# Altium project 4-Bit-BCD-Adder-Subtractor.PrjPcb
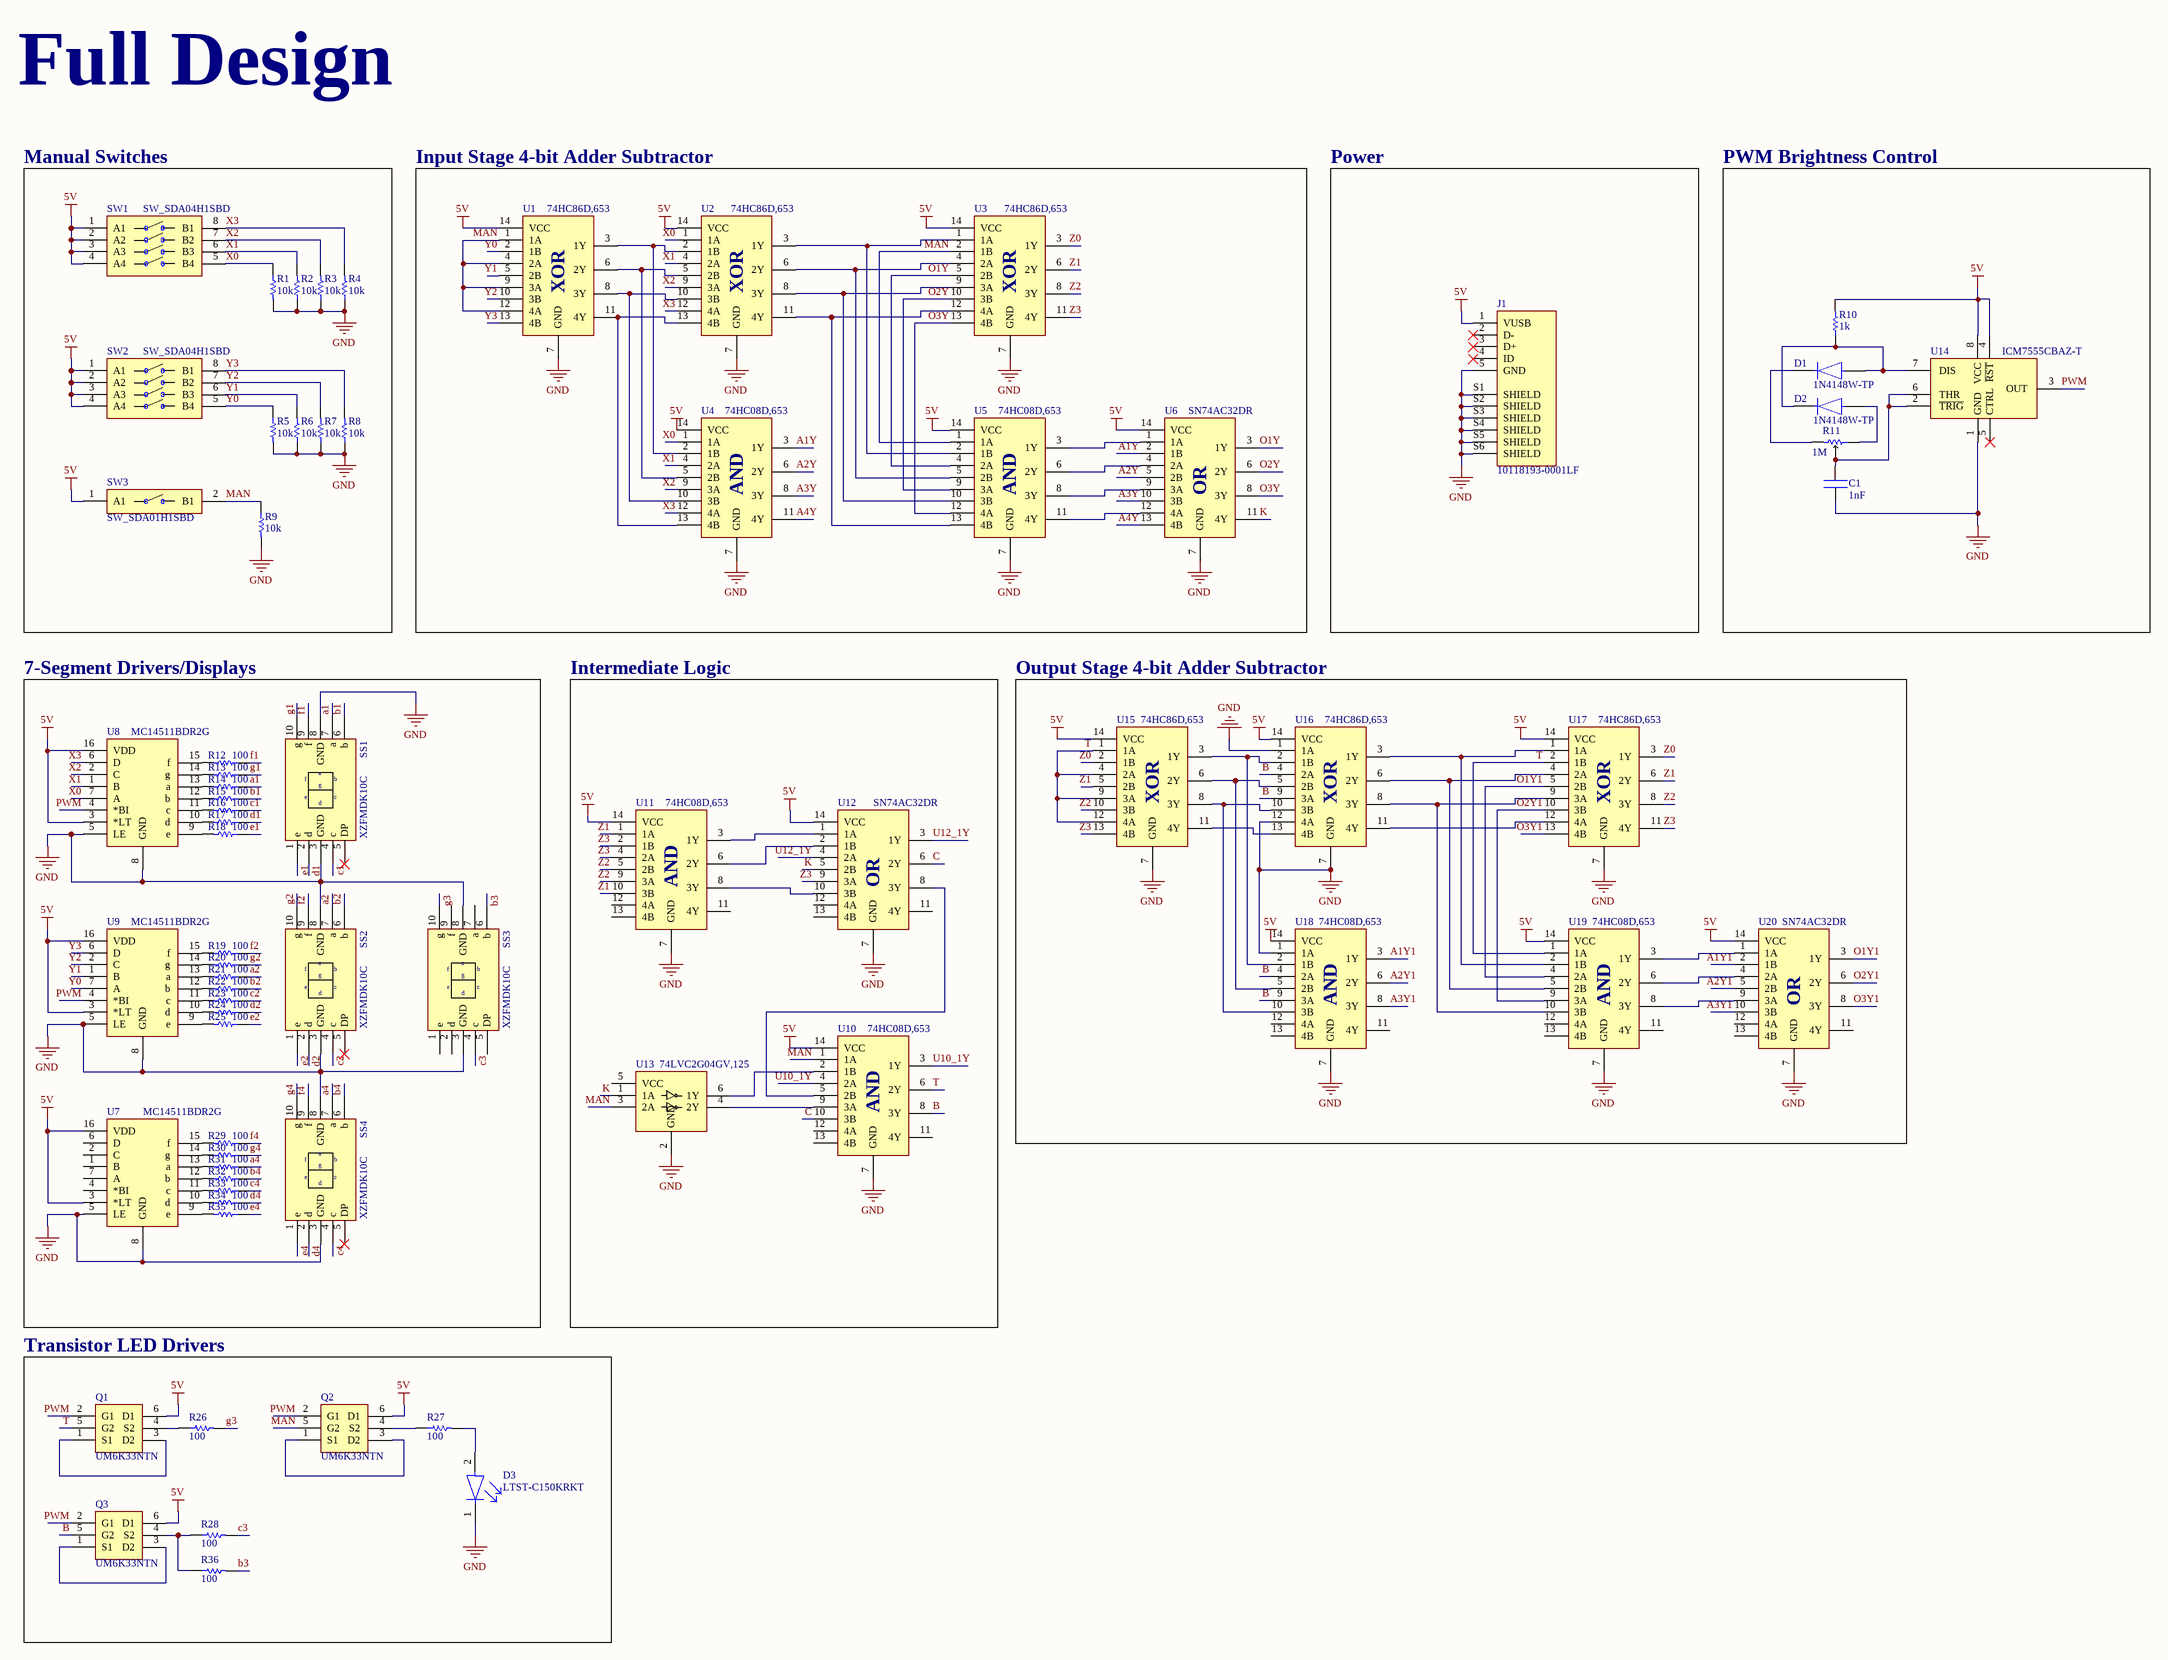
[diagram p0: 4B-BCD-AS.SchDoc]
1 sheet, 71 parts. Net scope: global (net labels, ports and power ports of the same name join across sheets).
Board file: PCB1.PcbDoc

## Sheet 4B-BCD-AS.SchDoc
size C; SheetNumber: 1; SheetTotal: 1

### Parts
C1  1nF  [FP-CL31-IPC_A]
D1  1N4148W-TP  [FP-SOD-123-MFG]
D2  1N4148W-TP  [FP-SOD-123-MFG]
D3  LTST-C150KRKT  [FP-LTST-C150KRKT-MFG]
J1  10118193-0001LF  [FCI_10118193-0001LF]
Q1  UM6K33NTN  [FP-SOT363-IPC_A]
Q2  UM6K33NTN  [FP-SOT363-IPC_A]
Q3  UM6K33NTN  [FP-SOT363-IPC_A]
R1  10k  [RESC3116X65X40ML10T20]
R2  10k  [RESC3116X65X40ML10T20]
R3  10k  [RESC3116X65X40ML10T20]
R4  10k  [RESC3116X65X40ML10T20]
R5  10k  [RESC3116X65X40ML10T20]
R6  10k  [RESC3116X65X40ML10T20]
R7  10k  [RESC3116X65X40ML10T20]
R8  10k  [RESC3116X65X40ML10T20]
R9  10k  [RESC3116X65X40ML10T20]
R10  1k  [RESC3116X65X40ML10T20]
R11  1M  [ST4ETA105]
R12  100  [RESC3116X65X40ML10T20]
R13  100  [RESC3116X65X40ML10T20]
R14  100  [RESC3116X65X40ML10T20]
R15  100  [RESC3116X65X40ML10T20]
R16  100  [RESC3116X65X40ML10T20]
R17  100  [RESC3116X65X40ML10T20]
R18  100  [RESC3116X65X40ML10T20]
R19  100  [RESC3116X65X40ML10T20]
R20  100  [RESC3116X65X40ML10T20]
R21  100  [RESC3116X65X40ML10T20]
R22  100  [RESC3116X65X40ML10T20]
R23  100  [RESC3116X65X40ML10T20]
R24  100  [RESC3116X65X40ML10T20]
R25  100  [RESC3116X65X40ML10T20]
R26  100  [RESC3116X65X40ML10T20]
R27  100  [RESC3116X65X40ML10T20]
R28  100  [RESC3116X65X40ML10T20]
R29  100  [RESC3116X65X40ML10T20]
R30  100  [RESC3116X65X40ML10T20]
R31  100  [RESC3116X65X40ML10T20]
R32  100  [RESC3116X65X40ML10T20]
R33  100  [RESC3116X65X40ML10T20]
R34  100  [RESC3116X65X40ML10T20]
R35  100  [RESC3116X65X40ML10T20]
R36  100  [RESC3116X65X40ML10T20]
SS1  XZFMDK10C  [XZFMDK10C]
SS2  XZFMDK10C  [XZFMDK10C]
SS3  XZFMDK10C  [XZFMDK10C]
SS4  XZFMDK10C  [XZFMDK10C]
SW1  SW_SDA04H1SBD  [SW_SDA04H1SBD]
SW2  SW_SDA04H1SBD  [SW_SDA04H1SBD]
SW3  SW_SDA01H1SBD  [SW_SDA01H1SBD]
U1  74HC86D,653  [SOIC127P600X175-14N]
U2  74HC86D,653  [SOIC127P600X175-14N]
U3  74HC86D,653  [SOIC127P600X175-14N]
U4  74HC08D,653  [SOIC127P600X175-14N]
U5  74HC08D,653  [SOIC127P600X175-14N]
U6  SN74AC32DR  [SOIC127P600X175-14N]
U7  MC14511BDR2G  [SOIC-16_ONS-M]
U8  MC14511BDR2G  [SOIC-16_ONS-M]
U9  MC14511BDR2G  [SOIC-16_ONS-M]
U10  74HC08D,653  [SOIC127P600X175-14N]
U11  74HC08D,653  [SOIC127P600X175-14N]
U12  SN74AC32DR  [SOIC127P600X175-14N]
U13  74LVC2G04GV,125  [SOT95P275X110-6N]
U14  ICM7555CBAZ-T  [FP-M8_15-MFG]
U15  74HC86D,653  [SOIC127P600X175-14N]
U16  74HC86D,653  [SOIC127P600X175-14N]
U17  74HC86D,653  [SOIC127P600X175-14N]
U18  74HC08D,653  [SOIC127P600X175-14N]
U19  74HC08D,653  [SOIC127P600X175-14N]
U20  SN74AC32DR  [SOIC127P600X175-14N]

### Blocks framed on the sheet
Manual Switches: R1-R9 SW1-SW3
Input Stage 4-bit Adder Subtractor: U1-U6
Power: J1
PWM Brightness Control: C1 D1 D2 R10 R11 U14
7-Segment Drivers/Displays: R12-R25 R29-R35 SS1-SS4 U7-U9
Intermediate Logic: U10-U13
Output Stage 4-bit Adder Subtractor: U15-U20
Transistor LED Drivers: D3 Q1-Q3 R26-R28 R36

### Nets
5V: J1.1(VUSB) Q1.6(D1) Q2.6(D1) Q3.6(D1) R10.2 SW1.1(A1) SW1.2(A2) SW1.3(A3) SW1.4(A4) SW2.1(A1) SW2.2(A2) SW2.3(A3) SW2.4(A4) SW3.1(A1) U1.14(VCC) U2.14(VCC) U3.14(VCC) U4.14(VCC) U5.14(VCC) U6.14(VCC) U7.3(*LT) U7.16(VDD) U8.3(*LT) U8.16(VDD) U9.3(*LT) U9.16(VDD) U10.14(VCC) U11.14(VCC) U12.14(VCC) U14.4(~{RST}) U14.8(VCC) U15.14(VCC) U16.14(VCC) U17.14(VCC) U18.14(VCC) U19.14(VCC) U20.14(VCC)
GND: C1.1 D3.1(C) J1.5(GND) J1.S1(SHIELD) J1.S2(SHIELD) J1.S3(SHIELD) J1.S4(SHIELD) J1.S5(SHIELD) J1.S6(SHIELD) R1.2 R2.1 R3.1 R4.1 R5.2 R6.1 R7.1 R8.1 R9.2 SS1.3(GND) SS1.8(GND) SS2.3(GND) SS2.8(GND) SS3.3(GND) SS3.8(GND) SS4.3(GND) SS4.8(GND) U1.7(GND) U2.7(GND) U3.7(GND) U4.7(GND) U5.7(GND) U6.7(GND) U7.5(LE) U7.8(GND) U8.5(LE) U8.8(GND) U9.5(LE) U9.8(GND) U10.7(GND) U11.7(GND) U12.7(GND) U13.2(GND) U14.1(GND) U15.7(GND) U16.1(1A) U16.7(GND) U16.12(4A) U17.7(GND) U18.1(1A) U18.7(GND) U19.7(GND) U20.7(GND)
a1: R14.1 SS1.7(a)
A1Y: U4.3(1Y) U6.2(1B)
A1Y1: U18.3(1Y) U20.2(1B)
a2: R21.1 SS2.7(a)
A2Y: U4.6(2Y) U6.5(2B)
A2Y1: U18.6(2Y) U20.5(2B)
A3Y: U4.8(3Y) U6.10(3B)
A3Y1: U18.8(3Y) U20.10(3B)
a4: R31.1 SS4.7(a)
A4Y: U4.11(4Y) U6.13(4B)
B: Q3.5(G2) U10.8(3Y) U16.4(2A) U16.9(3A) U18.4(2A) U18.9(3A)
b1: R15.1 SS1.6(b)
b2: R22.1 SS2.6(b)
b3: R36.2 SS3.6(b)
b4: R32.1 SS4.6(b)
C: U10.10(3B) U12.6(2Y)
c1: R16.1 SS1.4(c)
c2: R23.1 SS2.4(c)
c3: R28.2 SS3.4(c)
c4: R33.1 SS4.4(c)
d1: R17.1 SS1.2(d)
d2: R24.1 SS2.2(d)
d4: R34.1 SS4.2(d)
e1: R18.1 SS1.1(e)
e2: R25.1 SS2.1(e)
e4: R35.1 SS4.1(e)
f1: R12.1 SS1.9(f)
f2: R19.1 SS2.9(f)
f4: R29.1 SS4.9(f)
g1: R13.1 SS1.10(g)
g2: R20.1 SS2.10(g)
g3: R26.2 SS3.10(g)
g4: R30.1 SS4.10(g)
K: U6.11(4Y) U12.5(2B) U13.1(1A)
MAN: Q2.5(G2) R9.1 SW3.2(B1) U1.1(1A) U1.4(2A) U1.9(3A) U1.12(4A) U3.2(1B) U5.1(1A) U10.1(1A) U13.3(2A)
O1Y: U3.5(2B) U5.4(2A) U6.3(1Y)
O1Y1: U17.5(2B) U19.4(2A) U20.3(1Y)
O2Y: U3.10(3B) U5.9(3A) U6.6(2Y)
O2Y1: U17.10(3B) U19.9(3A) U20.6(2Y)
O3Y: U3.13(4B) U5.12(4A) U6.8(3Y)
O3Y1: U17.13(4B) U20.8(3Y)
PWM: Q1.2(G1) Q2.2(G1) Q3.2(G1) U8.4(*BI) U9.4(*BI) U14.3(OUT)
T: Q1.5(G2) U10.6(2Y) U15.1(1A) U15.4(2A) U15.9(3A) U15.12(4A) U17.2(1B) U19.1(1A)
U10_1Y: U10.3(1Y) U10.4(2A)
U12_1Y: U12.3(1Y) U12.4(2A)
X0: R1.1 SW1.5(B4) U2.1(1A) U4.1(1A) U8.7(A)
X1: R2.2 SW1.6(B3) U2.4(2A) U4.4(2A) U8.1(B)
X2: R3.2 SW1.7(B2) U2.9(3A) U4.9(3A) U8.2(C)
X3: R4.2 SW1.8(B1) U2.12(4A) U4.12(4A) U8.6(D)
Y0: R5.1 SW2.5(B4) U1.2(1B) U9.7(A)
Y1: R6.2 SW2.6(B3) U1.5(2B) U9.1(B)
Y2: R7.2 SW2.7(B2) U1.10(3B) U9.2(C)
Y3: R8.2 SW2.8(B1) U1.13(4B) U9.6(D)
Z0: U3.3(1Y) U15.2(1B) U17.3(1Y)
Z1: U3.6(2Y) U11.1(1A) U11.10(3B) U15.5(2B) U17.6(2Y)
Z2: U3.8(3Y) U11.5(2B) U11.9(3A) U15.10(3B) U17.8(3Y)
Z3: U3.11(4Y) U11.2(1B) U11.4(2A) U12.9(3A) U15.13(4B) U17.11(4Y)
NetC1_2: C1.2 R11.2 U14.2(~{TRIG}) U14.6(THR)
NetD1_1: D1.1(C) R11.3
NetD1_2: D1.2(A) D2.1(C) R10.1 U14.7(DIS)
NetD2_2: D2.2(A) R11.1
NetD3_2: D3.2(A) R27.2
NetQ1_1: Q1.1(S1) Q1.3(D2)
NetQ1_4: Q1.4(S2) R26.1
NetQ2_1: Q2.1(S1) Q2.3(D2)
NetQ2_4: Q2.4(S2) R27.1
NetQ3_1: Q3.1(S1) Q3.3(D2)
NetQ3_4: Q3.4(S2) R28.1 R36.1
NetR12_2: R12.2 U8.15(f)
NetR13_2: R13.2 U8.14(g)
NetR14_2: R14.2 U8.13(a)
NetR15_2: R15.2 U8.12(b)
NetR16_2: R16.2 U8.11(c)
NetR17_2: R17.2 U8.10(d)
NetR18_2: R18.2 U8.9(e)
NetR19_2: R19.2 U9.15(f)
NetR20_2: R20.2 U9.14(g)
NetR21_2: R21.2 U9.13(a)
NetR22_2: R22.2 U9.12(b)
NetR23_2: R23.2 U9.11(c)
NetR24_2: R24.2 U9.10(d)
NetR25_2: R25.2 U9.9(e)
NetR29_2: R29.2 U7.15(f)
NetR30_2: R30.2 U7.14(g)
NetR31_2: R31.2 U7.13(a)
NetR32_2: R32.2 U7.12(b)
NetR33_2: R33.2 U7.11(c)
NetR34_2: R34.2 U7.10(d)
NetR35_2: R35.2 U7.9(e)
NetU1_3: U1.3(1Y) U2.2(1B) U4.2(1B)
NetU1_6: U1.6(2Y) U2.5(2B) U4.5(2B)
NetU1_8: U1.8(3Y) U2.10(3B) U4.10(3B)
NetU1_11: U1.11(4Y) U2.13(4B) U4.13(4B)
NetU2_3: U2.3(1Y) U3.1(1A) U5.2(1B)
NetU2_6: U2.6(2Y) U3.4(2A) U5.5(2B)
NetU2_8: U2.8(3Y) U3.9(3A) U5.10(3B)
NetU2_11: U2.11(4Y) U3.12(4A) U5.13(4B)
NetU5_3: U5.3(1Y) U6.1(1A)
NetU5_6: U5.6(2Y) U6.4(2A)
NetU5_8: U5.8(3Y) U6.9(3A)
NetU5_11: U5.11(4Y) U6.12(4A)
NetU10_2: U10.2(1B) U13.6(1Y)
NetU10_5: U10.5(2B) U12.8(3Y)
NetU10_9: U10.9(3A) U13.4(2Y)
NetU11_3: U11.3(1Y) U12.1(1A)
NetU11_6: U11.6(2Y) U12.2(1B)
NetU11_8: U11.8(3Y) U12.10(3B)
NetU15_3: U15.3(1Y) U16.2(1B) U18.2(1B)
NetU15_6: U15.6(2Y) U16.5(2B) U18.5(2B)
NetU15_8: U15.8(3Y) U16.10(3B) U18.10(3B)
NetU15_11: U15.11(4Y) U16.13(4B)
NetU16_3: U16.3(1Y) U17.1(1A) U19.2(1B)
NetU16_6: U16.6(2Y) U17.4(2A) U19.5(2B)
NetU16_8: U16.8(3Y) U17.9(3A) U19.10(3B)
NetU16_11: U16.11(4Y) U17.12(4A)
NetU19_3: U19.3(1Y) U20.1(1A)
NetU19_6: U19.6(2Y) U20.4(2A)
NetU19_8: U19.8(3Y) U20.9(3A)

Not connected (* = marked no-connect by the designer): J1 2(D-)* 3(D+)* 4(ID)*; SS1 5(DP)*; SS2 5(DP)*; SS3 1(e) 2(d) 5(DP) 7(a) 9(f); SS4 5(DP)*; U7 1(B) 2(C) 4(*BI) 6(D) 7(A); U10 11(4Y) 12(4A) 13(4B); U11 11(4Y) 12(4A) 13(4B); U12 11(4Y) 12(4A) 13(4B); U13 5(VCC); U14 5(CTRL)*; U18 11(4Y) 12(4A) 13(4B); U19 11(4Y) 12(4A) 13(4B); U20 11(4Y) 12(4A) 13(4B)

### Notes on the sheet
- Full Design
- (in symbol 74HC08D,653) AND
- (in symbol 74HC86D,653) XOR
- (in symbol SN74AC32DR) OR

### Library data of the parts
C1 = CMP-13271-001948-1: Cap Ceramic 1nF 50V X7R ±10% SMD 1206 +125°C Embossed T/R; Voltage: 63V; Case Code (Imperial): 1206; Depth: 1.6mm; Case Code (Metric): 3216; Width: 0.063inch; Package Quantity: 4000; Height: 0.85mm; Max Operating Temperature: 125°C; Radiation Hardening: No; Thickness: 0.037inch; Tolerance: 10%; Case/Package: 1206; Packaging: Tape and Reel; Voltage Rating (DC): 50V; Min Operating Temperature: -55°C; Material: Ceramic; Capacitance: 1nF; Length: 3.2mm; Voltage Rating: 50V; Mount: Surface Mount; Lead Free: Lead Free; Dielectric: X7R
D1 D2 = CMP-2000-04993-2: DIODE GEN PURP 100V 150MA SOD123; Max Reverse Leakage Current: 5uA; Max Surge Current: 2A; Reverse Recovery Time: 4ns; Polarity: Standard; Capacitance: 4pF; Max Forward Surge Current (Ifsm): 1A; Element Configuration: Single; Power Dissipation: 400mW; Forward Voltage: 1V; Radiation Hardening: No; Lead Free: Lead Free; Max Reverse Voltage (DC): 100V; Current Rating: 150mA; Forward Current: 150mA; Packaging: Tape and Reel; Number of Pins: 2; Package Quantity: 3000; Max Operating Temperature: 150°C; Min Operating Temperature: -65°C; Average Rectified Current: 150mA; Recovery Time: 4ns; Output Current: 150mA; Peak Non-Repetitive Surge Current: 2A; Width: 1.8mm; Voltage Rating (DC): 100V; Height: 1.2mm; Max Repetitive Reverse Voltage (Vrrm): 100V; Mount: Surface Mount; Length: 2.85mm
D3 = CMP-2000-06617-2: LED RED CLEAR 1206 SMD; Wavelength: 639nm; Power Dissipation: 62.5mW; Luminous Intensity: 54mcd; Test Current: 20mA; Forward Current: 30mA; Reverse Voltage: 5V; Viewing Angle: 130°; Number of Elements: 1; Lens Style: Diffused; Power Rating: 75mW; Lens Color: Colorless; Forward Voltage: 2V; Dominant Wavelength: 631nm; Depth: 1.6mm; Mount: Surface Mount; Packaging: Tape and Reel; Case Code (Metric): 3216; Lens Transparency: Clear; Illumination Color: Red; Radiation Hardening: No; Min Operating Temperature: -30°C; Height: 1.1mm; Case Code (Imperial): 1206; Number of Pins: 2; Length: 3.2mm; Lead Free: Lead Free; Color: Red; Width: 1.6mm; Number of LEDs: 1; Max Operating Temperature: 85°C; Case/Package: 1206; Package Quantity: 1
J1 = 10118193-0001LF: USB - micro B USB 2.0 Receptacle Connector 5 Position Surface Mount, Right Angle; Through Hole; MF: Amphenol ICC; Availability: Unavailable; SnapEDA_Link: https://www.snapeda.com/parts/10118193-0001LF/Amphenol%20FCI/view-part/2758989/?ref=snap; MP: 10118193-0001LF; Price: None; Value: *; Package: None
Q1-Q3 = UM6K33NTN: MOSFET 2N-CH 50V 0.2A UMT6
R1-R9 = CMP-1014-00623-2: Manufacturer: Yageo; Tolerance: 1%; Voltage Rating: 200V; Resistance: 10KOhm; Temperature Coefficient: 100ppm/degreesC; Power Rating: 250mW; Packaging: TapeandReel; Termination: SMD/SMT; REACH SVHC: Unknown; Height: 0.55mm; Composition: ThickFilm; Max Operating Temperature: 155degC; Datasheet Version: Rev. 5, 10/2016; Lead Free: LeadFree; Case Code (Metric): 3216; Depth: 1.6mm; Package Quantity: 5000; RoHSCompliant: true; Military Standard: Not; Case/Package: 1206; Case Code (Imperial): 1206; Min Operating Temperature: -55degC; Datasheet URL: http://www.yageo.com/NewPortal/yageodocoutput?fileName=/pdf/R-Chip/PYu-RC_Group_51_RoHS_L_5.pdf; Length: 3.1mm; Manufacturer URL: http://www.yageo.com/; Package Reference: 1206.0; Width: 1.6mm; Package Description: 2-Pin Surface Mount Device, Body 3.1 x 1.6 mm
R10 = RC1206FR-071KL
R11 = ST4ETA105: TRIMMER 1M OHM 0.25W J LEAD TOP
R12-R36 = RC1206FR-07100RL: RES 100 OHM 1% 1/4W 1206
SS1-SS4 = XZFMDK10C: DISPLAY 7-SEG 0.4" SGL RED 10SMD
SW1 SW2 = SW_SDA04H1SBD: SWITCH SLIDE DIP SPST
SW3 = SW_SDA01H1SBD: SWITCH SLIDE DIP SPST
U1-U3 U15-U17 = 74HC86D,653: XOR 4 Channel 14-SO; MF: Nexperia USA; Digi-Key_Purchase_URL: https://www.digikey.com/product-detail/en/nexperia-usa-inc/74HC86D,653/1727-2827-1-ND/763396?utm_source=snapeda&utm_medium=aggregator&utm_campaign=symbol; Package: SOIC-14 NXP Semiconductors; SnapEDA_Link: https://www.snapeda.com/parts/74HC86D%2C653/Nexperia%20USA%20Inc./view-part/462082/?ref=snap; Value: *; MP: 74HC86D,653; Digi-Key_Part_Number: 1727-2827-1-ND
U4 U5 U10 U11 U18 U19 = 74HC08D,653: AND 4 Channel 14-SO; MF: Nexperia USA; MP: 74HC86D,653; Digi-Key_Purchase_URL: https://www.digikey.com/product-detail/en/nexperia-usa-inc/74HC86D,653/1727-2827-1-ND/763396?utm_source=snapeda&utm_medium=aggregator&utm_campaign=symbol; Package: SOIC-14 NXP Semiconductors; SnapEDA_Link: https://www.snapeda.com/parts/74HC86D%2C653/Nexperia%20USA%20Inc./view-part/462082/?ref=snap; Value: *; Digi-Key_Part_Number: 1727-2827-1-ND
U6 U12 U20 = SN74AC32DR: OR 4 Channel 14-SO; MF: Nexperia USA; MP: 74HC86D,653; Digi-Key_Purchase_URL: https://www.digikey.com/product-detail/en/nexperia-usa-inc/74HC86D,653/1727-2827-1-ND/763396?utm_source=snapeda&utm_medium=aggregator&utm_campaign=symbol; Package: SOIC-14 NXP Semiconductors; SnapEDA_Link: https://www.snapeda.com/parts/74HC86D%2C653/Nexperia%20USA%20Inc./view-part/462082/?ref=snap; Value: *; Digi-Key_Part_Number: 1727-2827-1-ND
U7-U9 = MC14511BDR2G: IC DRVR 7 SEGMENT 16SOIC; Mfr_Name: onsemi; Copyright: Copyright (C) 2022 Ultra Librarian. All rights reserved.; Manufacturer_Part_Number: MC14511BDR2G; RefDes: RefDes; Type: DEV
U13 = 74LVC2G04GV,125: IC INVERTER 2CH 2-INP 6TSOP
U14 = CMP-13501-000001-1: IC OSC SINGLE TIMER 1MHZ 8-SOIC